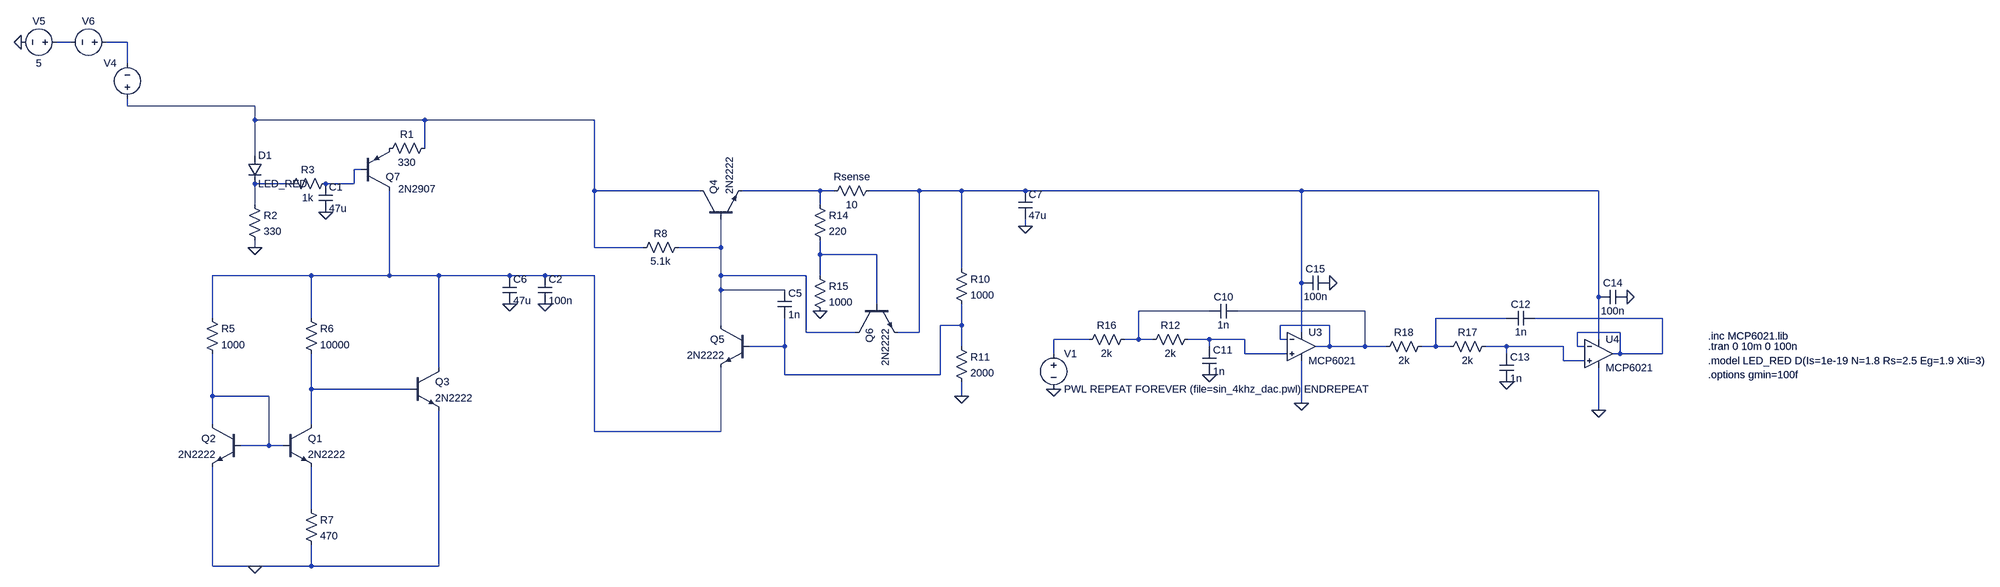
[diagram p0: schematic filter.asc]
filter.asc, the LTspice schematic file:
Version 4.1
SHEET 1 3984 1684
WIRE -464 224 -496 224
WIRE -336 224 -384 224
WIRE -336 272 -336 224
WIRE -336 368 -336 352
WIRE -48 368 -336 368
WIRE -48 400 -48 368
WIRE 336 400 -48 400
WIRE 720 400 336 400
WIRE 336 464 336 400
WIRE -48 480 -48 400
WIRE 192 512 176 512
WIRE 32 544 -48 544
WIRE 176 544 176 512
WIRE 176 544 112 544
WIRE 720 560 720 400
WIRE 976 560 720 560
WIRE 1248 560 1072 560
WIRE 1280 560 1248 560
WIRE 1472 560 1360 560
WIRE 1568 560 1472 560
WIRE 1712 560 1568 560
WIRE 2336 560 1712 560
WIRE 3008 560 2336 560
WIRE -48 592 -48 544
WIRE 1248 592 1248 560
WIRE 1712 640 1712 624
WIRE -48 688 -48 672
WIRE 720 688 720 560
WIRE 848 688 720 688
WIRE 1024 688 1024 624
WIRE 1024 688 928 688
WIRE 1248 704 1248 672
WIRE 1376 704 1248 704
WIRE 1568 736 1568 560
WIRE 80 752 -144 752
WIRE 256 752 256 560
WIRE 256 752 80 752
WIRE 368 752 256 752
WIRE 528 752 368 752
WIRE 608 752 528 752
WIRE 720 752 608 752
WIRE 1024 752 1024 688
WIRE 1216 752 1024 752
WIRE 1248 752 1248 704
WIRE 2336 768 2336 560
WIRE 1024 784 1024 752
WIRE 1168 784 1024 784
WIRE 3008 800 3008 560
WIRE 1376 816 1376 704
WIRE 2128 832 1968 832
WIRE 2480 832 2192 832
WIRE -144 848 -144 752
WIRE 80 848 80 752
WIRE 2800 848 2640 848
WIRE 3152 848 2864 848
WIRE 1024 864 1024 784
WIRE 1568 864 1568 816
WIRE 1568 864 1520 864
WIRE 2400 864 2288 864
WIRE 1216 880 1216 752
WIRE 1328 880 1216 880
WIRE 1472 880 1472 560
WIRE 1472 880 1424 880
WIRE 2336 880 2336 768
WIRE 3056 880 2960 880
WIRE 1856 896 1776 896
WIRE 1968 896 1968 832
WIRE 1968 896 1936 896
WIRE 2000 896 1968 896
WIRE 2128 896 2080 896
WIRE 2208 896 2128 896
WIRE 2288 896 2288 864
WIRE 2304 896 2288 896
WIRE 3008 896 3008 800
WIRE 1168 912 1168 848
WIRE 1168 912 1088 912
WIRE 1568 912 1568 864
WIRE 2128 912 2128 896
WIRE 2400 912 2400 864
WIRE 2400 912 2368 912
WIRE 2480 912 2480 832
WIRE 2480 912 2400 912
WIRE 2528 912 2480 912
WIRE 2640 912 2640 848
WIRE 2640 912 2608 912
WIRE 2672 912 2640 912
WIRE 2800 912 2752 912
WIRE 2928 912 2800 912
WIRE 2960 912 2960 880
WIRE 2976 912 2960 912
WIRE 1776 928 1776 896
WIRE 2208 928 2208 896
WIRE 2304 928 2208 928
WIRE 2800 928 2800 912
WIRE 3056 928 3056 880
WIRE 3056 928 3040 928
WIRE 3152 928 3152 848
WIRE 3152 928 3056 928
WIRE 2928 944 2928 912
WIRE 2976 944 2928 944
WIRE 368 960 368 752
WIRE 1168 976 1168 912
WIRE 1520 976 1520 864
WIRE 1520 976 1168 976
WIRE 80 1008 80 928
WIRE 304 1008 80 1008
WIRE -144 1024 -144 928
WIRE -16 1024 -144 1024
WIRE 1568 1024 1568 992
WIRE 2336 1040 2336 944
WIRE 3008 1056 3008 960
WIRE -144 1088 -144 1024
WIRE 80 1088 80 1008
WIRE 720 1104 720 752
WIRE 1024 1104 1024 960
WIRE 1024 1104 720 1104
WIRE -16 1136 -16 1024
WIRE -16 1136 -80 1136
WIRE 16 1136 -16 1136
WIRE 80 1280 80 1184
WIRE -144 1408 -144 1184
WIRE -48 1408 -144 1408
WIRE 80 1408 80 1360
WIRE 80 1408 -48 1408
WIRE 368 1408 368 1056
WIRE 368 1408 80 1408
FLAG -48 1408 0
FLAG -576 224 0
FLAG 1248 832 0
FLAG 1568 1024 0
FLAG 528 816 0
FLAG 1712 640 0
FLAG 2336 1040 0
FLAG 2128 976 0
FLAG 1776 1008 0
FLAG 3008 1056 0
FLAG 2800 992 0
FLAG 2400 768 0
FLAG 3072 800 0
FLAG -48 688 0
FLAG 112 608 0
FLAG 608 816 0
SYMBOL res -160 832 R0
SYMATTR InstName R5
SYMATTR Value 1000
SYMBOL res 64 832 R0
SYMATTR InstName R6
SYMATTR Value 10000
SYMBOL res 64 1264 R0
SYMATTR InstName R7
SYMATTR Value 470
SYMBOL voltage -336 368 R180
WINDOW 0 24 96 Left 2
WINDOW 3 24 16 Invisible 2
WINDOW 123 0 0 Left 0
WINDOW 39 0 0 Left 0
SYMATTR InstName V4
SYMATTR Value SINE(0 0.1 100)
SYMBOL voltage -480 224 R90
WINDOW 0 -32 56 VBottom 2
WINDOW 3 32 56 VTop 2
WINDOW 123 0 0 Left 0
WINDOW 39 0 0 Left 0
SYMATTR InstName V5
SYMATTR Value 5
SYMBOL npn 304 960 R0
SYMATTR InstName Q3
SYMATTR Value 2N2222
SYMBOL voltage -368 224 R90
WINDOW 0 -32 56 VBottom 2
WINDOW 3 32 56 Invisible 2
WINDOW 123 0 0 Left 0
WINDOW 39 0 0 Left 0
SYMATTR InstName V6
SYMATTR Value SINE(0 .1 100k)
SYMBOL npn 16 1088 R0
SYMATTR InstName Q1
SYMATTR Value 2N2222
SYMBOL npn -80 1088 M0
SYMATTR InstName Q2
SYMATTR Value 2N2222
SYMBOL npn 976 624 R270
SYMATTR InstName Q4
SYMATTR Value 2N2222
SYMBOL npn 1088 864 M0
SYMATTR InstName Q5
SYMATTR Value 2N2222
SYMBOL res 1376 544 R90
WINDOW 0 0 56 VBottom 2
WINDOW 3 32 56 VTop 2
SYMATTR InstName Rsense
SYMATTR Value 10
SYMBOL res 1232 576 R0
SYMATTR InstName R14
SYMATTR Value 220
SYMBOL res 1232 736 R0
SYMATTR InstName R15
SYMATTR Value 1000
SYMBOL npn 1328 816 M90
SYMATTR InstName Q6
SYMATTR Value 2N2222
SYMBOL res 1552 720 R0
SYMATTR InstName R10
SYMATTR Value 1000
SYMBOL res 1552 896 R0
SYMATTR InstName R11
SYMATTR Value 2000
SYMBOL cap 1152 784 R0
SYMATTR InstName C5
SYMATTR Value 1n
SYMBOL cap 512 752 R0
SYMATTR InstName C6
SYMATTR Value 47u
SYMBOL cap 1696 560 R0
SYMATTR InstName C7
SYMATTR Value 47u
SYMBOL res 944 672 R90
WINDOW 0 0 56 VBottom 2
WINDOW 3 32 56 VTop 2
SYMATTR InstName R8
SYMATTR Value 5.1k
SYMBOL OpAmps\\opamp2 2336 848 R0
SYMATTR InstName U3
SYMATTR Value MCP6021
SYMBOL cap 2192 816 R90
WINDOW 0 0 32 VBottom 2
WINDOW 3 32 32 VTop 2
SYMATTR InstName C10
SYMATTR Value 1n
SYMBOL res 2096 880 R90
WINDOW 0 0 56 VBottom 2
WINDOW 3 32 56 VTop 2
SYMATTR InstName R12
SYMATTR Value 2k
SYMBOL cap 2112 912 R0
SYMATTR InstName C11
SYMATTR Value 1n
SYMBOL res 1952 880 R90
WINDOW 0 0 56 VBottom 2
WINDOW 3 32 56 VTop 2
SYMATTR InstName R16
SYMATTR Value 2k
SYMBOL voltage 1776 912 R0
WINDOW 123 24 124 Left 2
WINDOW 39 0 0 Left 0
SYMATTR InstName V1
SYMATTR Value PWL REPEAT FOREVER (file=sin_4khz_dac.pwl) ENDREPEAT
SYMBOL OpAmps\\opamp2 3008 864 R0
SYMATTR InstName U4
SYMATTR Value MCP6021
SYMBOL cap 2864 832 R90
WINDOW 0 0 32 VBottom 2
WINDOW 3 32 32 VTop 2
SYMATTR InstName C12
SYMATTR Value 1n
SYMBOL res 2768 896 R90
WINDOW 0 0 56 VBottom 2
WINDOW 3 32 56 VTop 2
SYMATTR InstName R17
SYMATTR Value 2k
SYMBOL cap 2784 928 R0
SYMATTR InstName C13
SYMATTR Value 1n
SYMBOL res 2624 896 R90
WINDOW 0 0 56 VBottom 2
WINDOW 3 32 56 VTop 2
SYMATTR InstName R18
SYMATTR Value 2k
SYMBOL cap 3072 784 R90
WINDOW 0 0 32 VBottom 2
WINDOW 3 32 32 VTop 2
SYMATTR InstName C14
SYMATTR Value 100n
SYMBOL cap 2400 752 R90
WINDOW 0 0 32 VBottom 2
WINDOW 3 32 32 VTop 2
SYMATTR InstName C15
SYMATTR Value 100n
SYMBOL res -64 576 R0
SYMATTR InstName R2
SYMATTR Value 330
SYMBOL pnp 192 560 M180
WINDOW 3 84 4 Left 2
SYMATTR InstName Q7
SYMATTR Value 2N2907
SYMBOL res 352 448 R90
WINDOW 0 0 56 VBottom 2
WINDOW 3 32 56 VTop 2
SYMATTR InstName R1
SYMATTR Value 330
SYMBOL cap 96 544 R0
SYMATTR InstName C1
SYMATTR Value 47u
SYMBOL res 128 528 R90
WINDOW 0 0 56 VBottom 2
WINDOW 3 32 56 VTop 2
SYMATTR InstName R3
SYMATTR Value 1k
SYMBOL cap 592 752 R0
SYMATTR InstName C2
SYMATTR Value 100n
SYMBOL diode -64 480 R0
SYMATTR InstName D1
SYMATTR Value LED_RED
TEXT 3304 888 Left 2 !.inc MCP6021.lib
TEXT 3304 912 Left 2 !.tran 0 10m 0 100n
TEXT 3304 976 Left 2 !.options gmin=100f
TEXT 3304 944 Left 2 !.model LED_RED D(Is=1e-19 N=1.8 Rs=2.5 Eg=1.9 Xti=3)

The netlist it stands for:
* filter.asc
R5 N010 N020 1000
R6 N010 N019 10000
R7 N021 0 470
V4 N003 N002 SINE(0 0.1 100)
V5 N001 0 5
Q3 N010 N019 0 0 2N2222
V6 N002 N001 SINE(0 .1 100k)
Q1 N019 N020 N021 0 2N2222
Q2 N020 N020 0 0 2N2222
Q4 N003 N008 N006 0 2N2222
Q5 N008 N015 N010 0 2N2222
Rsense N007 N006 10
R14 N006 N009 220
R15 N009 0 1000
Q6 N008 N009 N007 0 2N2222
R10 N007 N015 1000
R11 N015 0 2000
C5 N008 N015 1n
C6 N010 0 47u
C7 N007 0 47u
R8 N008 N003 5.1k
X§U3 N017 N012 N007 0 N012 MCP6021  ; pins In+ In- V+ V- OUT
C10 N012 N011 1n
R12 N017 N011 2k
C11 N017 0 1n
R16 N011 N016 2k
V1 N016 0 PWL REPEAT FOREVER (file=sin_4khz_dac.pwl) ENDREPEAT
X§U4 N018 N014 N007 0 N014 MCP6021  ; pins In+ In- V+ V- OUT
C12 N014 N013 1n
R17 N018 N013 2k
C13 N018 0 1n
R18 N013 N012 2k
C14 0 N007 100n
C15 0 N007 100n
R2 N005 0 330
Q7 N010 N004 P001 0 2N2907
R1 N003 P001 330
C1 N004 0 47u
R3 N004 N005 1k
C2 N010 0 100n
D1 N003 N005 LED_RED
.model D D
.lib standard.dio
.model NPN NPN
.model PNP PNP
.lib standard.bjt
.inc MCP6021.lib
.tran 0 10m 0 100n
.options gmin=100f
.model LED_RED D(Is=1e-19 N=1.8 Rs=2.5 Eg=1.9 Xti=3)
.backanno
.end